# Altium schematic sheet LED24_26.SchDoc
size A4
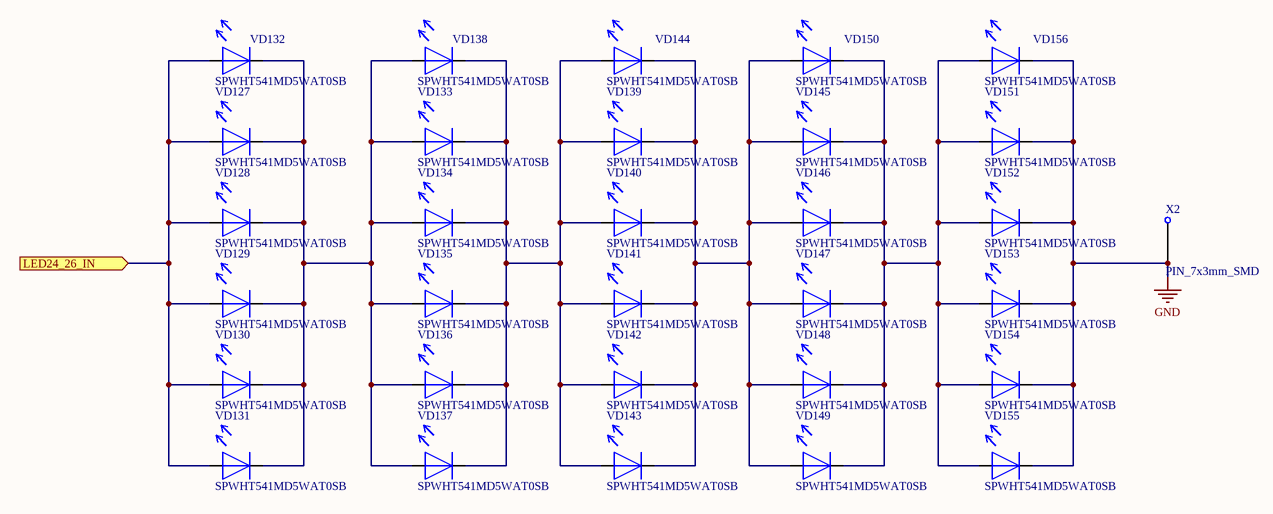
[diagram p0: LED24_26.SchDoc]

## Parts
VD127  SPWHT541MD5WAT0SB  [LED_SAMSUNG]
VD128  SPWHT541MD5WAT0SB  [LED_SAMSUNG]
VD129  SPWHT541MD5WAT0SB  [LED_SAMSUNG]
VD130  SPWHT541MD5WAT0SB  [LED_SAMSUNG]
VD131  SPWHT541MD5WAT0SB  [LED_SAMSUNG]
VD132  SPWHT541MD5WAT0SB  [LED_SAMSUNG]
VD133  SPWHT541MD5WAT0SB  [LED_SAMSUNG]
VD134  SPWHT541MD5WAT0SB  [LED_SAMSUNG]
VD135  SPWHT541MD5WAT0SB  [LED_SAMSUNG]
VD136  SPWHT541MD5WAT0SB  [LED_SAMSUNG]
VD137  SPWHT541MD5WAT0SB  [LED_SAMSUNG]
VD138  SPWHT541MD5WAT0SB  [LED_SAMSUNG]
VD139  SPWHT541MD5WAT0SB  [LED_SAMSUNG]
VD140  SPWHT541MD5WAT0SB  [LED_SAMSUNG]
VD141  SPWHT541MD5WAT0SB  [LED_SAMSUNG]
VD142  SPWHT541MD5WAT0SB  [LED_SAMSUNG]
VD143  SPWHT541MD5WAT0SB  [LED_SAMSUNG]
VD144  SPWHT541MD5WAT0SB  [LED_SAMSUNG]
VD145  SPWHT541MD5WAT0SB  [LED_SAMSUNG]
VD146  SPWHT541MD5WAT0SB  [LED_SAMSUNG]
VD147  SPWHT541MD5WAT0SB  [LED_SAMSUNG]
VD148  SPWHT541MD5WAT0SB  [LED_SAMSUNG]
VD149  SPWHT541MD5WAT0SB  [LED_SAMSUNG]
VD150  SPWHT541MD5WAT0SB  [LED_SAMSUNG]
VD151  SPWHT541MD5WAT0SB  [LED_SAMSUNG]
VD152  SPWHT541MD5WAT0SB  [LED_SAMSUNG]
VD153  SPWHT541MD5WAT0SB  [LED_SAMSUNG]
VD154  SPWHT541MD5WAT0SB  [LED_SAMSUNG]
VD155  SPWHT541MD5WAT0SB  [LED_SAMSUNG]
VD156  SPWHT541MD5WAT0SB  [LED_SAMSUNG]
X2  PIN_7x3mm_SMD  [PIN_7x3mm_SMD]

## Ports
LED24_26_IN (in)

## Nets
GND: VD151.2 VD152.2 VD153.2 VD154.2 VD155.2 VD156.2 X2.1
LED24_26_IN: VD127.1 VD128.1 VD129.1 VD130.1 VD131.1 VD132.1 ; port LED24_26_IN
NetVD127_2: VD127.2 VD128.2 VD129.2 VD130.2 VD131.2 VD132.2 VD133.1 VD134.1 VD135.1 VD136.1 VD137.1 VD138.1
NetVD133_2: VD133.2 VD134.2 VD135.2 VD136.2 VD137.2 VD138.2 VD139.1 VD140.1 VD141.1 VD142.1 VD143.1 VD144.1
NetVD139_2: VD139.2 VD140.2 VD141.2 VD142.2 VD143.2 VD144.2 VD145.1 VD146.1 VD147.1 VD148.1 VD149.1 VD150.1
NetVD145_2: VD145.2 VD146.2 VD147.2 VD148.2 VD149.2 VD150.2 VD151.1 VD152.1 VD153.1 VD154.1 VD155.1 VD156.1

## Library data of the parts
VD127-VD156 = LED SPWHT541MD5WAT0SB: Value: SPWHT541MD5WAT0SB